# EAGLE design vacuumboard_eurobot2014_r1 (EAGLE 6.3)
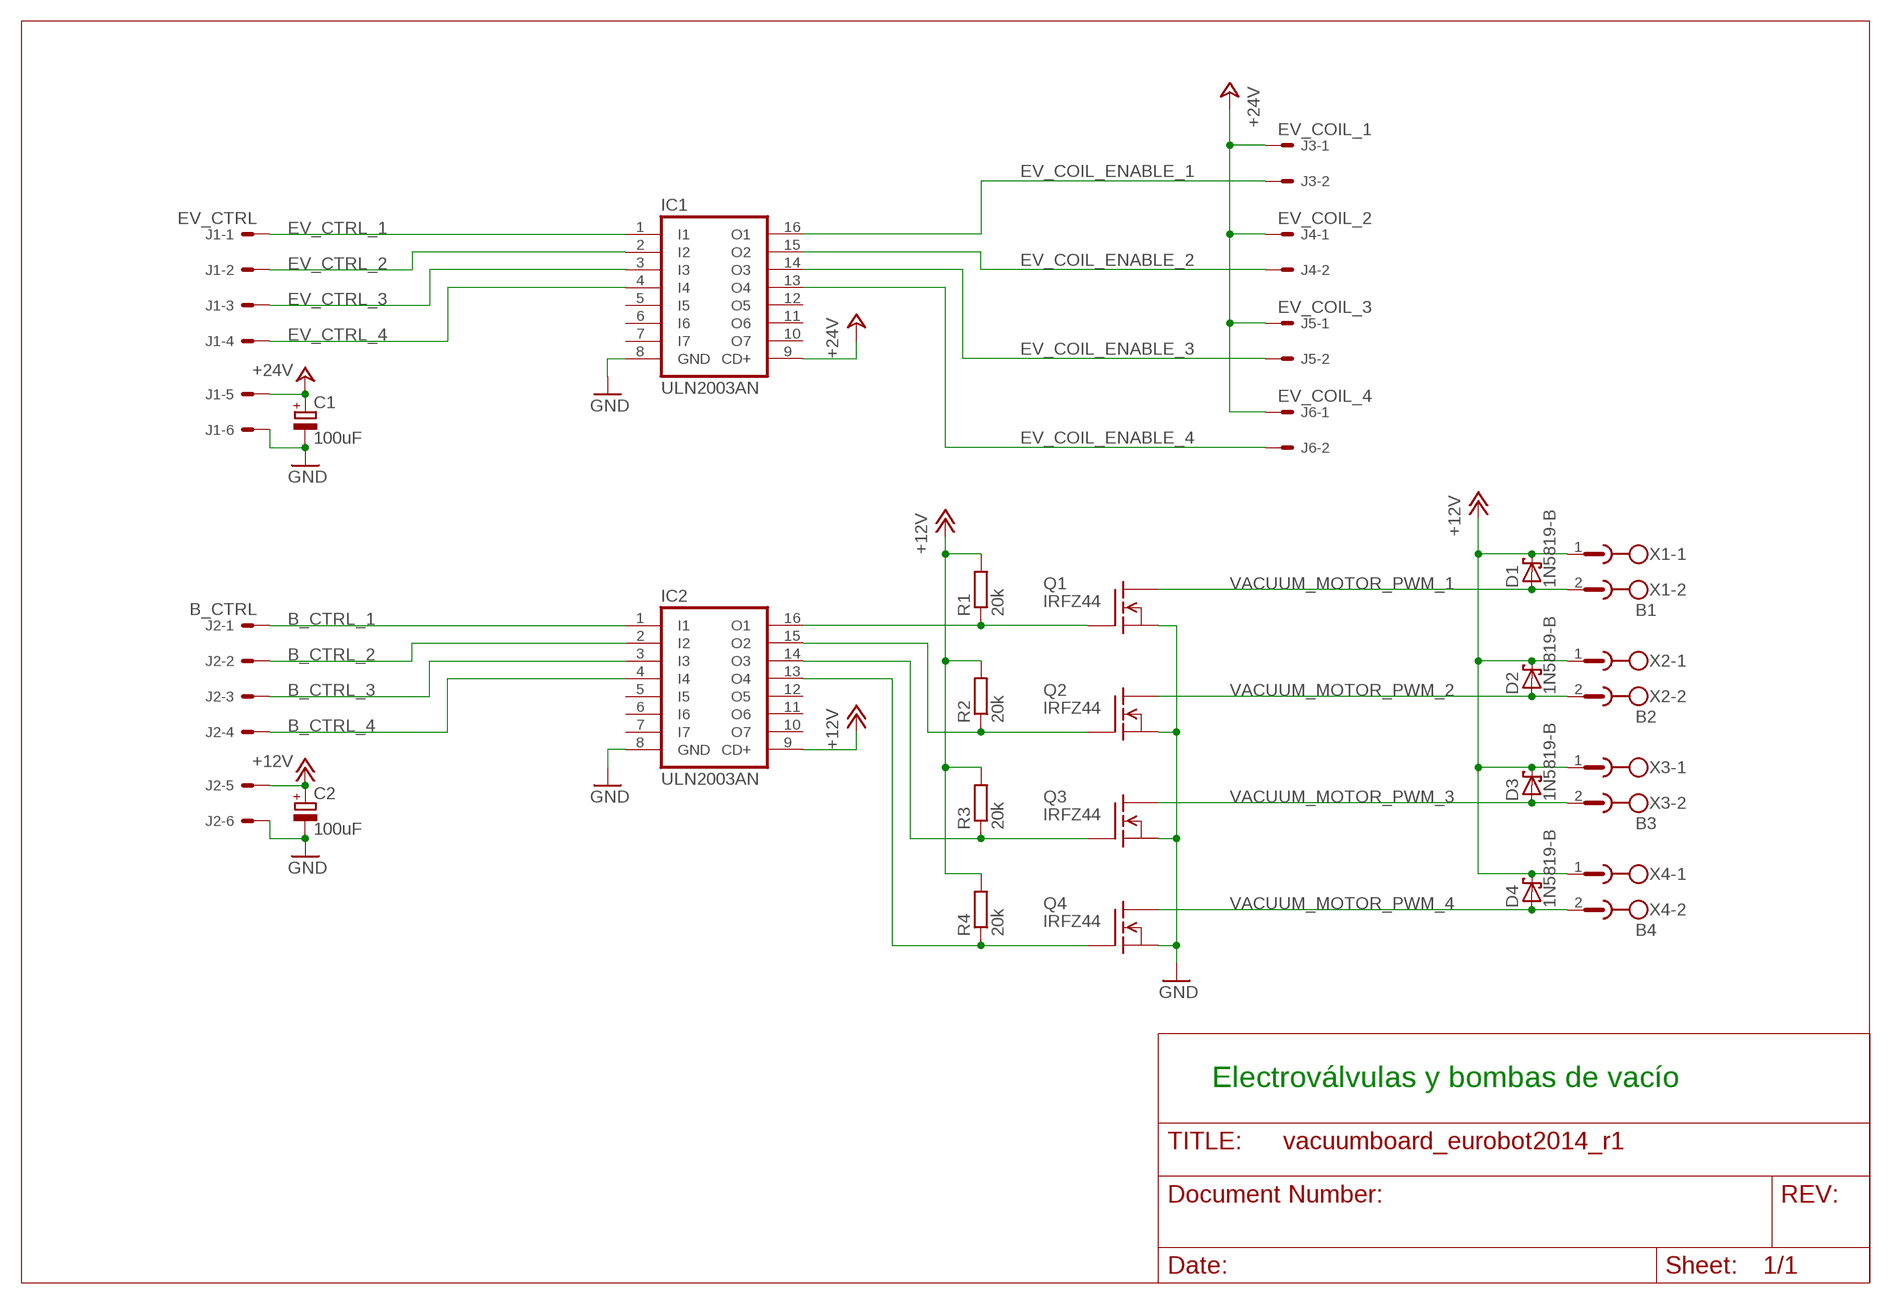
[diagram p0: schematic, sheet 1]

## Parts
C1  100uF  CPOL-EUE3.5-8  [E3,5-8]
C2  100uF  CPOL-EUE3.5-8  [E3,5-8]
D1  1N5819-B  [DO41-7.6]
D2  1N5819-B  [DO41-7.6]
D3  1N5819-B  [DO41-7.6]
D4  1N5819-B  [DO41-7.6]
IC1  ULN2003AN  [DIL16]
IC2  ULN2003AN  [DIL16]
J1  EV_CTRL  22-27-2061-06  [6410-06]
J2  B_CTRL  22-27-2061-06  [6410-06]
J3  EV_COIL_1  22-27-2021-02  [6410-02]
J4  EV_COIL_2  22-27-2021-02  [6410-02]
J5  EV_COIL_3  22-27-2021-02  [6410-02]
J6  EV_COIL_4  22-27-2021-02  [6410-02]
Q1  IRFZ44  IRF510  [TO220]
Q2  IRFZ44  IRF510  [TO220]
Q3  IRFZ44  IRF510  [TO220]
Q4  IRFZ44  IRF510  [TO220]
R1  20k  R-EU_R0805  [R0805]
R2  20k  R-EU_R0805  [R0805]
R3  20k  R-EU_R0805  [R0805]
R4  20k  R-EU_R0805  [R0805]
X1  B1  MSTBA2  [MSTBA2]
X2  B2  MSTBA2  [MSTBA2]
X3  B3  MSTBA2  [MSTBA2]
X4  B4  MSTBA2  [MSTBA2]

## Nets
+12V: C2.+ D1.C D2.C D3.C D4.C IC2.9(CD+) J2.5 R1.2 R2.2 R3.2 R4.2 X1.1 X2.1 X3.1 X4.1
+24V: C1.+ IC1.9(CD+) J1.5 J3.1 J4.1 J5.1 J6.1
B_CTRL_1: IC2.1(I1) J2.1
B_CTRL_2: IC2.2(I2) J2.2
B_CTRL_3: IC2.3(I3) J2.3
B_CTRL_4: IC2.4(I4) J2.4
EV_COIL_ENABLE_1: IC1.16(O1) J3.2
EV_COIL_ENABLE_2: IC1.15(O2) J4.2
EV_COIL_ENABLE_3: IC1.14(O3) J5.2
EV_COIL_ENABLE_4: IC1.13(O4) J6.2
EV_CTRL_1: IC1.1(I1) J1.1
EV_CTRL_2: IC1.2(I2) J1.2
EV_CTRL_3: IC1.3(I3) J1.3
EV_CTRL_4: IC1.4(I4) J1.4
GND: C1.- C2.- IC1.8(GND) IC2.8(GND) J1.6 J2.6 Q1.3(S) Q2.3(S) Q3.3(S) Q4.3(S)
N$2: IC2.16(O1) Q1.1(G) R1.1
N$3: IC2.15(O2) Q2.1(G) R2.1
N$4: IC2.14(O3) Q3.1(G) R3.1
N$5: IC2.13(O4) Q4.1(G) R4.1
VACUUM_MOTOR_PWM_1: D1.A Q1.2(D) X1.2
VACUUM_MOTOR_PWM_2: D2.A Q2.2(D) X2.2
VACUUM_MOTOR_PWM_3: D3.A Q3.2(D) X3.2
VACUUM_MOTOR_PWM_4: D4.A Q4.2(D) X4.2
Unconnected: IC1.5(I5) IC1.6(I6) IC1.7(I7) IC1.10(O7) IC1.11(O6) IC1.12(O5) IC2.5(I5) IC2.6(I6) IC2.7(I7) IC2.10(O7) IC2.11(O6) IC2.12(O5)

## Notes on the sheet
- Electroválvulas y bombas de vacío

## Library data of the parts
C1 C2 = resistor:CPOL-EU: POLARIZED CAPACITOR, European symbol
D1-D4 = diode:1N581*: 1.0A SCHOTTKY BARRIER RECTIFIER Source: http://www.diodes.com/datasheets/ds23001.pdf
IC1 IC2 = uln-udn:ULN2003A: DRIVER ARRAY
J1 J2 = con-molex:22-?-06: CONNECTOR wire to board 2.54 mm (.1 inch) pitch header; OC_FARNELL: unknown; OC_NEWARK: unknown
J3-J6 = con-molex:22-?-02: CONNECTOR wire to board 2.54 mm (.1 inch) pitch header; OC_FARNELL: unknown; OC_NEWARK: unknown
Q1-Q4 = transistor-fet:IRF510: N-Channel Enhancement MOSFET (HEXFET); 100V; 5,6A; 0,54Ohm
R1-R4 = resistor:R-EU_: RESISTOR, European symbol
X1-X4 = con-phoenix-508:MSTBA2: PHOENIX; MF: FARNELL; MPN: 1757242; OC_FARNELL: 3705171; OC_NEWARK: 71C4161

## Board
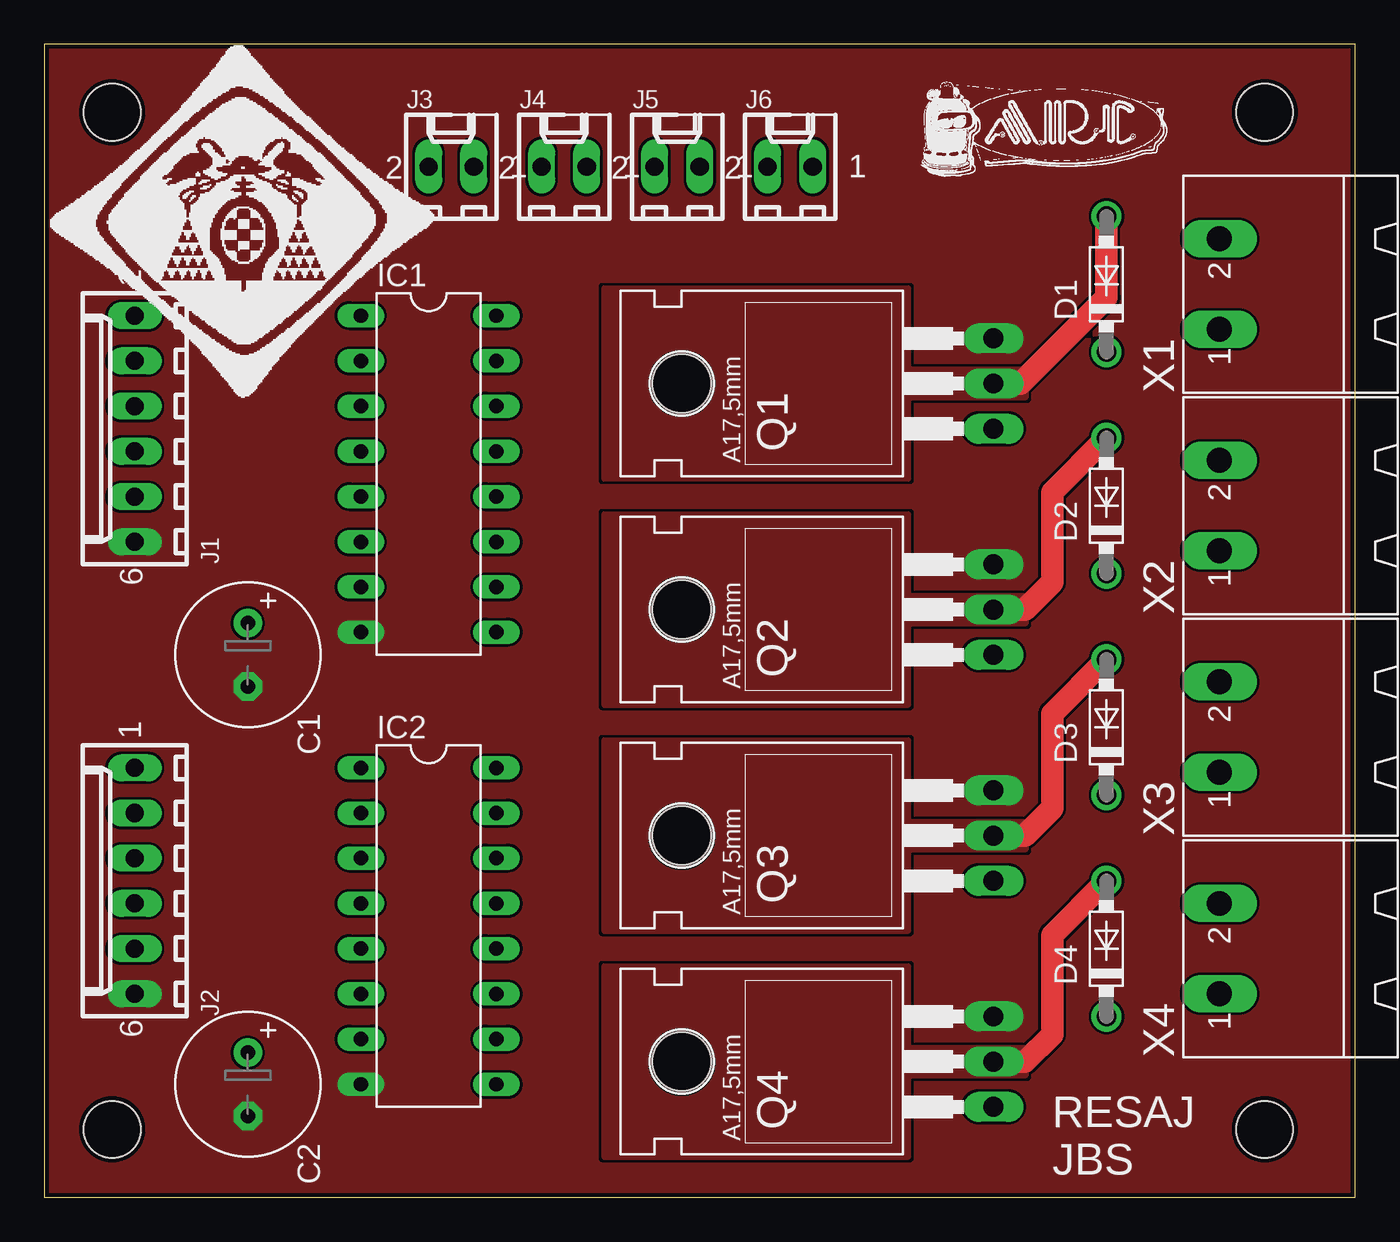
[diagram p1: board, top side]
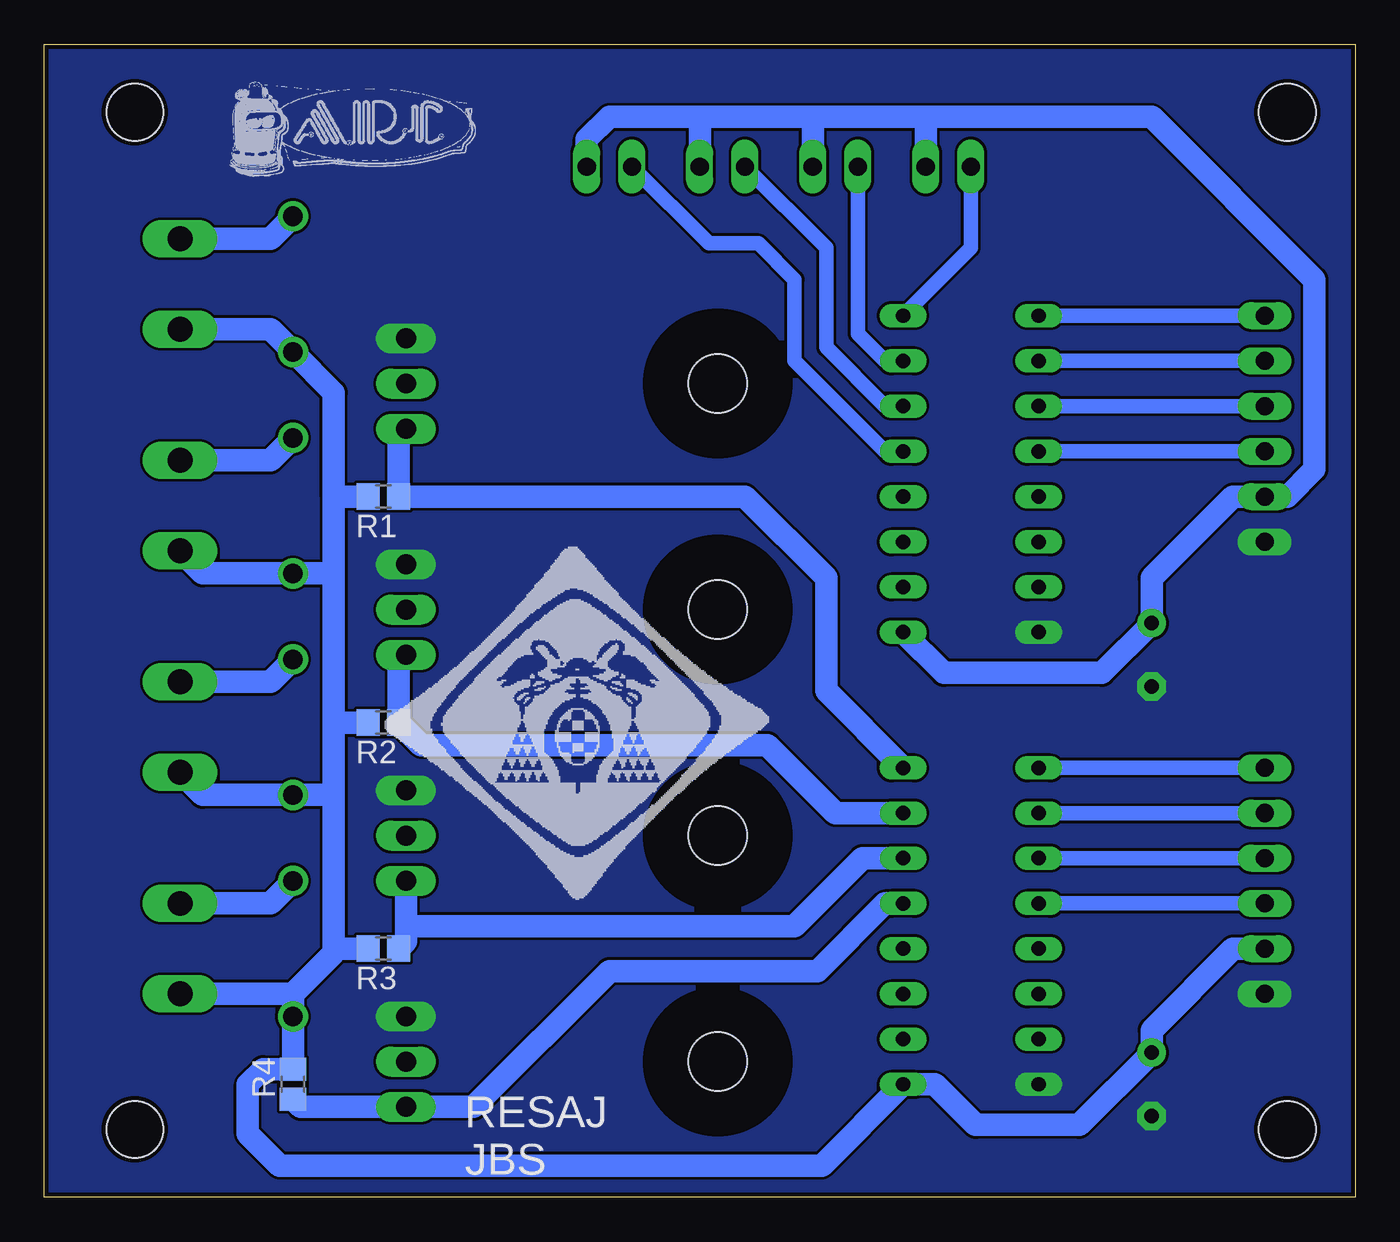
[diagram p2: board, bottom side, seen from below]

Size 73.66 x 64.77 mm. Coordinates in mm from the lower left corner, seen from the top.
Outline: 0,0 73.66,0 73.66,64.77 0,64.77 0,0
Copper layers (1*16): Top 0.035mm / dielectric 1.5mm / Bottom 0.035mm
Design rules "ITEADstudio_DRC": minimum track width 6mil, minimum drill 12mil, track to track 6mil, track to pad 6mil, pad to pad 6mil, via to via 6mil, smd to smd 0mil, copper to edge 10mil, drill to drill 10mil, minimum pad ring 10mil, minimum via ring 6mil, stop-mask expansion 2mil, vias tented up to drill 100mil, thermal gap 10mil
Holes 3.2 mm at 3.81,3.81 68.58,3.81 68.58,60.96 3.81,60.96

### Footprints (pad centres in the part's own frame; a part is rotated, then mirrored left to right if it is on the bottom)
E3,5-8 = drill 0.813 pad 1.6: + -1.778,0 | drill 0.813 pad 1.6 octagon: - 1.778,0
DO41-7.6 = drill 1.1 pad 1.7: A 3.81,0; C -3.81,0
DIL16 = drill 0.813 long: 1 -8.89,-3.81; 2 -6.35,-3.81; 3 -3.81,-3.81; 4 -1.27,-3.81; 5 1.27,-3.81; 6 3.81,-3.81; 7 6.35,-3.81; 8 8.89,-3.81; 9 8.89,3.81; 10 6.35,3.81; 11 3.81,3.81; 12 1.27,3.81; 13 -1.27,3.81; 14 -3.81,3.81; 15 -6.35,3.81; 16 -8.89,3.81
6410-06 = drill 1.016 long: 1 6.35,0; 2 3.81,0; 3 1.27,0; 4 -1.27,0; 5 -3.81,0; 6 -6.35,0
6410-02 = drill 1.016 long: 1 1.27,0; 2 -1.27,0
TO220 = drill 1.118 long: 1 -2.54,-6.35; 2 0,-6.35; 3 2.54,-6.35 | hole 3.302: 0,11.176
R0805 = smd 1.3 x 1.5: 1 -0.85,0; 2 0.85,0
MSTBA2 = drill 1.397 long: 1 -2.54,5.08; 2 2.54,5.08

### Placement (x,y rotation side)
C1  11.43,30.48 270 top
C2  11.43,6.35 270 top
D1  59.69,51.31 90 top
D2  59.69,38.86 90 top
D3  59.69,26.42 90 top
D4  59.69,13.97 90 top
IC1  21.59,40.64 270 top
IC2  21.59,15.24 270 top
J1  5.08,43.18 90 top
J2  5.08,17.78 90 top
J3  22.86,57.91 0 top
J4  29.21,57.91 0 top
J5  35.56,57.91 0 top
J6  41.91,57.91 0 top
Q1  46.99,45.72 90 top
Q2  46.99,33.02 90 top
Q3  46.99,20.32 90 top
Q4  46.99,7.62 90 top
R1  54.61,39.37 180 bottom
R2  54.61,26.67 180 bottom
R3  54.61,13.97 180 bottom
R4  59.69,6.35 90 bottom
U$1  [LOGO_ARC_13MM]  56.39,59.69 0 top
U$2  [LOGO_ARC_13MM]  56.13,59.69 0 bottom
U$3  [LOGO_IEEE_22MM]  11.18,54.86 0 top
U$4  [LOGO_IEEE_22MM]  43.69,26.67 0 bottom
X1  71.12,51.31 90 top
X2  71.12,38.86 90 top
X3  71.12,26.42 90 top
X4  71.12,13.97 90 top

### Tracks (layer width: path | path; a pad name or v marks a point on that pad's centre or on a via)
+12V
  Bottom 1.27: 59.69,11.43 X4.1 | X1.1 60.96,48.77 D1.C 57.4,45.21 57.4,39.37 | 59.69,11.43 D4.C R4.2 61.38,7.2 62.23,6.35 62.23,3.56 60.45,1.78 29.97,1.78 IC2.9 23.62,6.35 21.34,4.06 15.49,4.06 C2.+ 11.43,9.4 6.86,13.97 J2.5 | 57.4,26.67 57.4,22.61 | 57.4,22.61 57.4,13.97 | 57.4,13.97 R3.2 | 59.69,11.43 57.4,13.72 57.4,13.97 | 57.4,26.67 R2.2 | 57.4,22.61 D3.C 64.77,22.61 X3.1 | X2.1 64.77,35.05 D2.C 57.4,35.05 | R1.2 57.4,39.37 | 57.4,39.37 57.4,35.05 | 57.4,35.05 57.4,26.67
+24V
  Bottom 1.27: IC1.9 23.11,29.46 14.22,29.46 C1.+ 11.43,34.8 6.86,39.37 J1.5 3.81,39.37 2.29,40.89 2.29,51.56 11.43,60.71 24.13,60.71 | J6.1 43.18,59.44 41.91,60.71 36.83,60.71 | 36.83,60.71 30.48,60.71 | 30.48,60.71 24.13,60.71 | J3.1 24.13,60.71 | J4.1 30.48,60.71 | J5.1 36.83,60.71
B_CTRL_1
  Bottom 0.813: J2.1 IC2.1
B_CTRL_2
  Bottom 0.813: IC2.2 J2.2
B_CTRL_3
  Bottom 0.813: J2.3 IC2.3
B_CTRL_4
  Bottom 0.813: IC2.4 J2.4
EV_COIL_ENABLE_1
  Bottom 0.813: IC1.16 21.59,53.34 J3.2
EV_COIL_ENABLE_2
  Bottom 0.813: IC1.15 26.42,46.99 27.94,48.51 J4.2
EV_COIL_ENABLE_3
  Bottom 0.813: IC1.14 26.42,44.45 29.72,47.75 29.72,53.34 J5.2
EV_COIL_ENABLE_4
  Bottom 0.813: IC1.13 26.42,41.91 31.5,46.99 31.5,51.56 33.53,53.59 36.32,53.59 J6.2
EV_CTRL_1
  Bottom 0.813: J1.1 IC1.1
EV_CTRL_2
  Bottom 0.813: J1.2 IC1.2
EV_CTRL_3
  Bottom 0.813: J1.3 IC1.3
EV_CTRL_4
  Bottom 0.813: J1.4 IC1.4
GND
  pour Top (rank 2, no thermals): 0,64.77 73.66,64.77 73.66,0 0,0
  pour Bottom (rank 2, no thermals): 0,64.77 73.66,64.77 73.66,0 0,0
N$2
  Bottom 1.27: Q1.1 53.76,42.76 R1.1 34.29,39.37 29.72,34.8 29.72,28.45 IC2.16
N$3
  Bottom 1.27: IC2.15 29.21,21.59 33.02,25.4 52.49,25.4 R2.1 53.76,30.06 Q2.1
N$4
  Bottom 1.27: IC2.14 27.69,19.05 31.5,15.24 53.34,15.24 | 53.34,15.24 Q3.1 | R3.1 53.34,14.39 53.34,15.24
N$5
  Bottom 1.27: IC2.13 26.42,16.51 30.23,12.7 41.91,12.7 49.53,5.08 Q4.1 59.27,5.08 R4.1
VACUUM_MOTOR_PWM_1
  Top 1.27: Q1.2 54.86,45.72 59.69,50.55 D1.A
  Bottom 1.27: X1.2 60.96,53.85 D1.A
  pour Top (no thermals): 31.5,51.05 48.51,51.05 48.51,46.48 55.12,46.48 55.12,44.96 48.51,44.96 48.51,40.39 31.5,40.39
VACUUM_MOTOR_PWM_2
  Top 1.27: Q2.2 55.12,33.02 56.64,34.54 56.64,39.62 D2.A
  Bottom 1.27: X2.2 60.96,41.4 D2.A
  pour Top (no thermals): 31.5,38.35 48.51,38.35 48.51,33.78 55.12,33.78 55.12,32.26 48.51,32.26 48.51,27.69 31.5,27.69
VACUUM_MOTOR_PWM_3
  Top 1.27: Q3.2 55.12,20.32 56.64,21.84 56.64,27.18 D3.A
  Bottom 1.27: X3.2 60.96,28.96 D3.A
  pour Top (no thermals): 31.5,25.65 48.51,25.65 48.51,21.08 55.12,21.08 55.12,19.56 48.51,19.56 48.51,14.99 31.5,14.99
VACUUM_MOTOR_PWM_4
  Top 1.27: Q4.2 55.12,7.62 56.64,9.14 56.64,14.73 D4.A
  Bottom 1.27: X4.2 60.96,16.51 D4.A
  pour Top (no thermals): 31.5,12.95 48.51,12.95 48.51,8.38 55.12,8.38 55.12,6.86 48.51,6.86 48.51,2.29 31.5,2.29

### Text on the board
tPlace: RESAJ / JBS
bPlace: RESAJ / JBS